# EAGLE design OSC4ReTHM (EAGLE 7.4.0)
DOC_NUM: DR20000114; REV: 04
Assembly variants: 12kHz, 14kHz, 16kHz, 18kHz, 20kHz
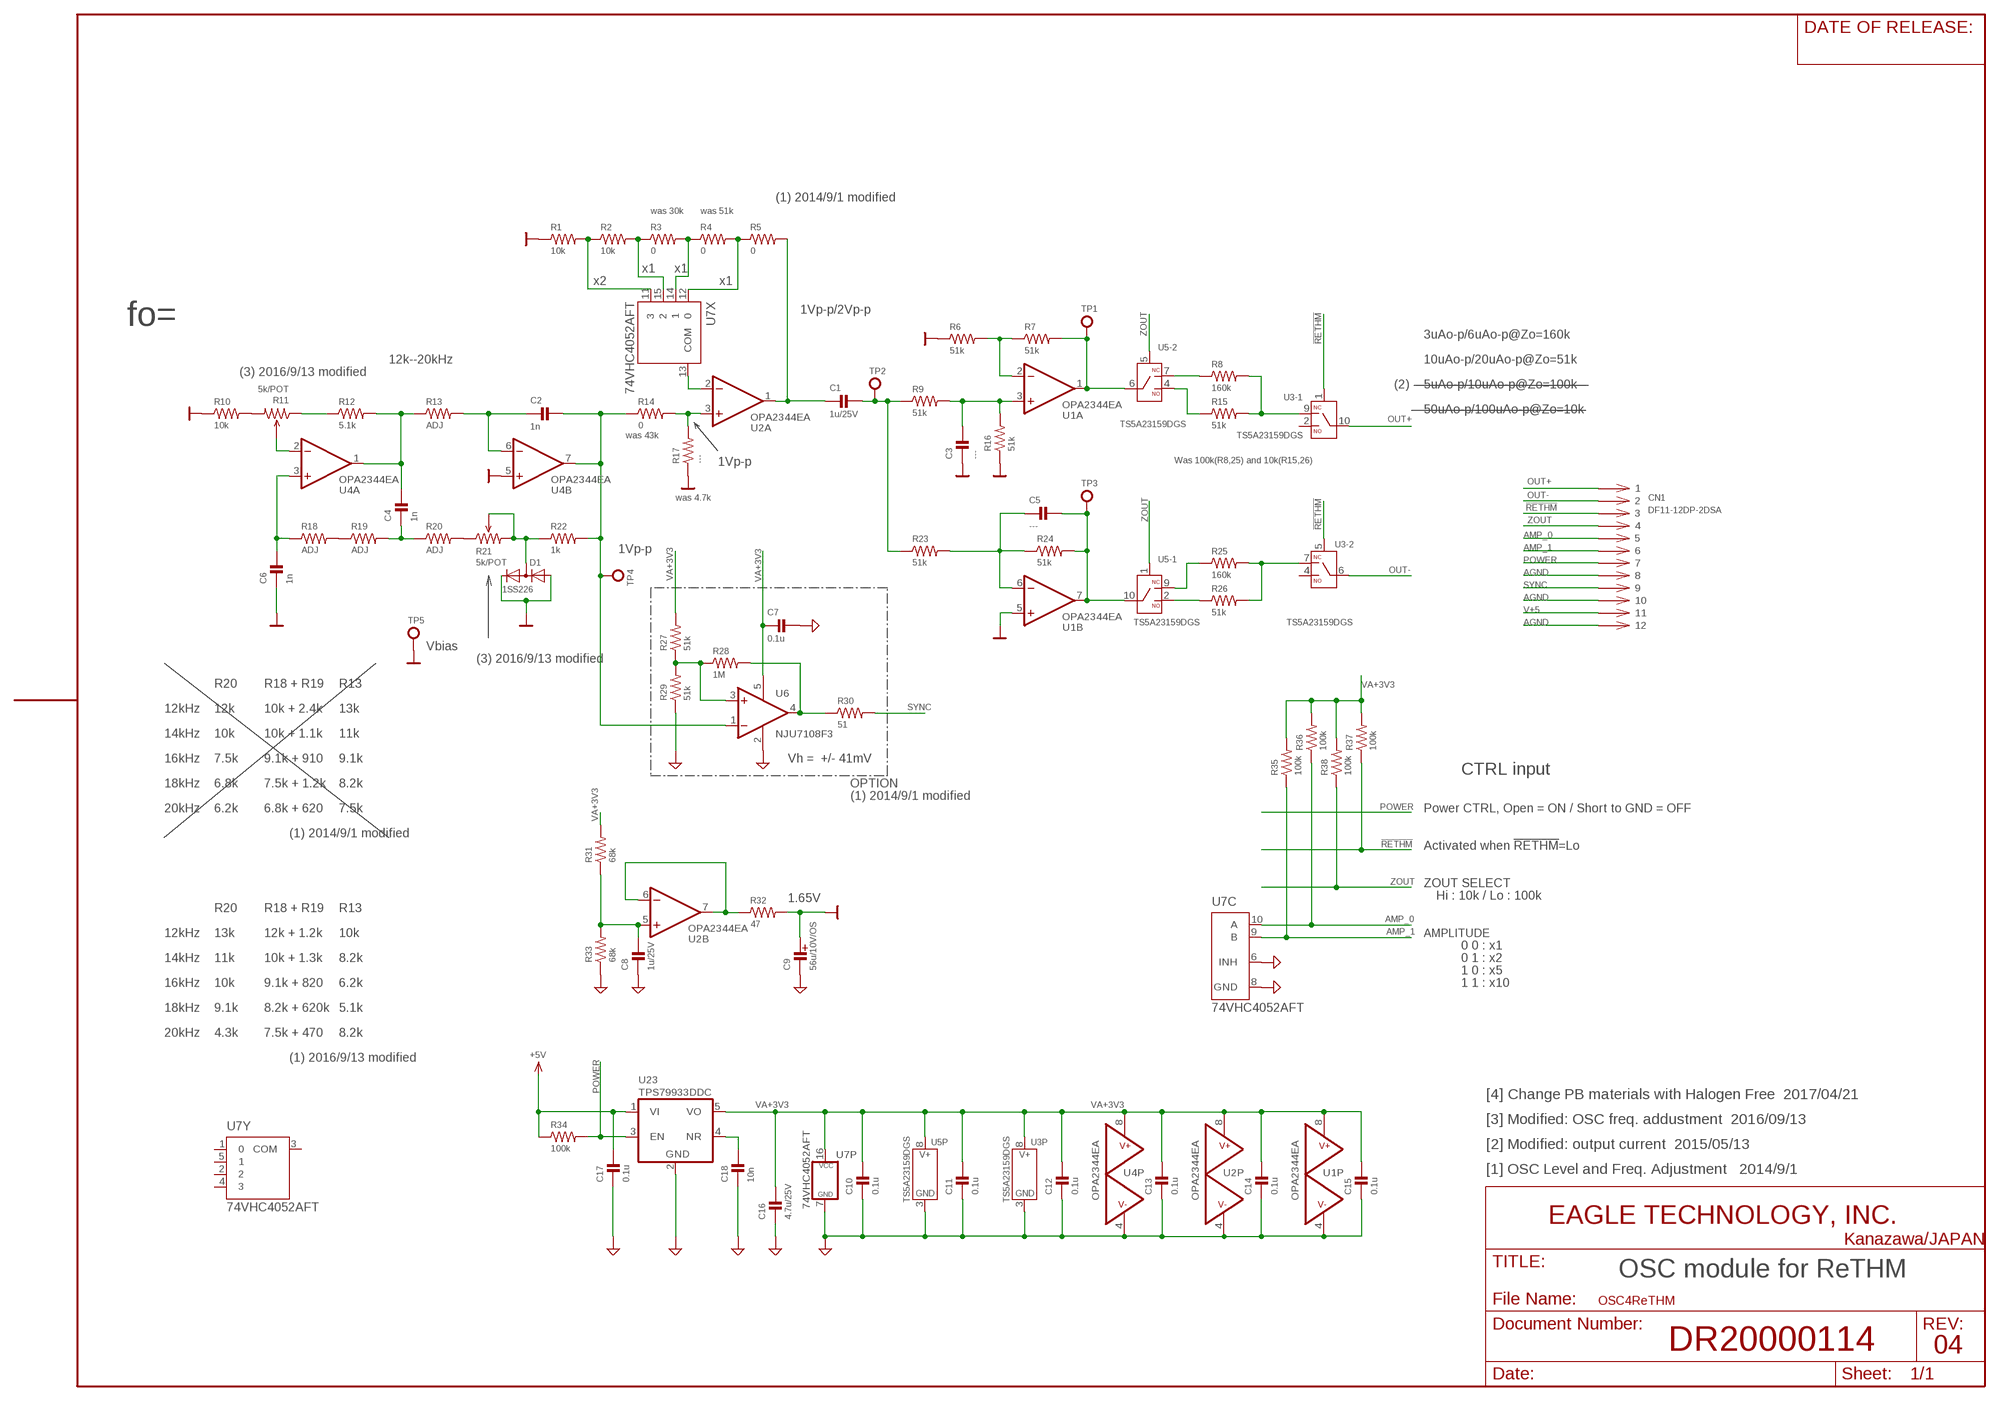
[diagram p0: schematic, sheet 1]

## Parts
C1  1u/25V  CSMD1.6X0.8MM  [CM1608]
C2  1n  CSMD2.0X1.2MM  [CM2012]
C3  ---  CSMD2.0X1.2MM  [CM2012]
C4  1n  CSMD2.0X1.2MM  [CM2012]
C5  ---  CSMD2.0X1.2MM  [CM2012]
C6  1n  CSMD2.0X1.2MM  [CM2012]
C7  0.1u  CSMD1.6X0.8MM  [CM1608]  (not fitted in variant 12kHz)  (not fitted in variant 14kHz)  (not fitted in variant 16kHz)  (not fitted in variant 18kHz)  (not fitted in variant 20kHz)
C8  1u/25V  CSMD1.6X0.8MM  [CM1608]
C9  56u/10V/OS  C_POL6.3-2.5MM  [PHI_6.3]
C10  0.1u  CSMD1.6X0.8MM  [CM1608]
C11  0.1u  CSMD1.6X0.8MM  [CM1608]
C12  0.1u  CSMD1.6X0.8MM  [CM1608]
C13  0.1u  CSMD1.6X0.8MM  [CM1608]
C14  0.1u  CSMD1.6X0.8MM  [CM1608]
C15  0.1u  CSMD1.6X0.8MM  [CM1608]
C16  4.7u/25V  CSMD2.0X1.2MM  [CM2012]
C17  0.1u  CSMD1.6X0.8MM  [CM1608]
C18  10n  CSMD2.0X1.2MM  [CM2012]
CN1  DF11-12DP-2DSA  [DF11-12DP-2DSA]
D1  1SS226  [SOT23]
R1  10k  RSMD1.6X0.8MM  [RM1608]
R2  10k  RSMD1.6X0.8MM  [RM1608]
R3  0  RSMD1.6X0.8MM  [RM1608]
R4  0  RSMD1.6X0.8MM  [RM1608]
R5  0  RSMD1.6X0.8MM  [RM1608]
R6  51k  RSMD1.6X0.8MM  [RM1608]
R7  51k  RSMD1.6X0.8MM  [RM1608]
R8  160k  RSMD1.6X0.8MM  [RM1608]
R9  51k  RSMD1.6X0.8MM  [RM1608]
R10  10k  RSMD1.6X0.8MM  [RM1608]
R11  5k/POT  R_POT  [CT-6]
R12  5.1k  RSMD1.6X0.8MM  [RM1608]
R13  ADJ  RSMD1.6X0.8MM  [RM1608]  (variant 12kHz: 13k)  (variant 14kHz: 11k)  (variant 16kHz: 10k)  (variant 18kHz: 9.1k)  (variant 20kHz: 8.2k)
R14  0  RSMD1.6X0.8MM  [RM1608]
R15  51k  RSMD1.6X0.8MM  [RM1608]
R16  51k  RSMD1.6X0.8MM  [RM1608]
R17  ---  RSMD1.6X0.8MM  [RM1608]
R18  ADJ  RSMD1.6X0.8MM  [RM1608]  (variant 12kHz: 12k)  (variant 14kHz: 10k)  (variant 16kHz: 9.1k)  (variant 18kHz: 8.2k)  (variant 20kHz: 7.5k)
R19  ADJ  RSMD1.6X0.8MM  [RM1608]  (variant 12kHz: 1.2k)  (variant 14kHz: 1.3k)  (variant 16kHz: 820)  (variant 18kHz: 620)  (variant 20kHz: 470)
R20  ADJ  RSMD1.6X0.8MM  [RM1608]  (variant 12kHz: 10k)  (variant 14kHz: 8.2k)  (variant 16kHz: 6.2k)  (variant 18kHz: 5.1k)  (variant 20kHz: 4.3k)
R21  5k/POT  R_POT  [CT-6]
R22  1k  RSMD1.6X0.8MM  [RM1608]
R23  51k  RSMD1.6X0.8MM  [RM1608]
R24  51k  RSMD1.6X0.8MM  [RM1608]
R25  160k  RSMD1.6X0.8MM  [RM1608]
R26  51k  RSMD1.6X0.8MM  [RM1608]
R27  51k  RSMD1.6X0.8MM  [RM1608]  (not fitted in variant 12kHz)  (not fitted in variant 14kHz)  (not fitted in variant 16kHz)  (not fitted in variant 18kHz)  (not fitted in variant 20kHz)
R28  1M  RSMD1.6X0.8MM  [RM1608]  (not fitted in variant 12kHz)  (not fitted in variant 14kHz)  (not fitted in variant 16kHz)  (not fitted in variant 18kHz)  (not fitted in variant 20kHz)
R29  51k  RSMD1.6X0.8MM  [RM1608]  (not fitted in variant 12kHz)  (not fitted in variant 14kHz)  (not fitted in variant 16kHz)  (not fitted in variant 18kHz)  (not fitted in variant 20kHz)
R30  51  RSMD1.6X0.8MM  [RM1608]  (not fitted in variant 12kHz)  (not fitted in variant 14kHz)  (not fitted in variant 16kHz)  (not fitted in variant 18kHz)  (not fitted in variant 20kHz)
R31  68k  RSMD1.6X0.8MM  [RM1608]
R32  47  RSMD1.6X0.8MM  [RM1608]
R33  68k  RSMD1.6X0.8MM  [RM1608]
R34  100k  RSMD1.6X0.8MM  [RM1608]
R35  100k  RSMD1.6X0.8MM  [RM1608]
R36  100k  RSMD1.6X0.8MM  [RM1608]
R37  100k  RSMD1.6X0.8MM  [RM1608]
R38  100k  RSMD1.6X0.8MM  [RM1608]
TP1  TP-1PAD  [TP_PAD_1MM]
TP2  TP-LC3G  [TP_TH_0R9MM]
TP3  TP-1PAD  [TP_PAD_1MM]
TP4  TP-LC3G  [TP_TH_0R9MM]
TP5  TP-1PAD  [TP_PAD_1MM]
U1  OPA2344EA  OPA2344DGK  [MSO8_AEL]
U2  OPA2344EA  OPA2344DGK  [MSO8_AEL]
U3  TS5A23159DGS  [MSOP10]
U4  OPA2344EA  OPA2344DGK  [MSO8_AEL]
U5  TS5A23159DGS  [MSOP10]
U6  NJU7108F3  [SC88A]  (not fitted in variant 12kHz)  (not fitted in variant 14kHz)  (not fitted in variant 16kHz)  (not fitted in variant 18kHz)  (not fitted in variant 20kHz)
U7  74VHC4052AFT  [TSSOP16-P-044-065A]
U23  TPS79933DDC  [SOT-23-5]

## Nets
0V: C3.2 C6.2 C9.POS D1.1(A) D1.2(C) R1.1 R6.1 R10.1 R16.1 R17.1 R32.2 TP5.P$1(MP) U1.5(B:+IN) U4.5(B:+IN)
!RETHM: CN1.3 R37.1 U3.1(-1:IN) U3.5(-2:IN)
AGND: C7.1 C8.2 C9.NEG C10.2 C11.2 C12.2 C13.2 C14.2 C15.2 C16.2 C17.2 C18.2 CN1.8 CN1.10 CN1.12 R29.1 R33.1 U1.4(P:V-) U2.4(P:V-) U3.3(P:V-) U4.4(P:V-) U5.3(P:V-) U6.2(V-) U7.6(C:INH) U7.7(P:GND) U7.8(C:GND) U23.2(GND)
AMP_0: CN1.5 R36.1 U7.10(C:A)
AMP_1: CN1.6 R35.1 U7.9(C:B)
N$11: R20.2 R21.1
N$13: R10.2 R11.3
N$15: C18.1 U23.4(NR)
N$19: R1.2 R2.1 U7.11
N$21: R2.2 R3.1 U7.15
N$22: R3.2 R4.1 U7.14
N$25: R4.2 R5.1 U7.12
N$26: C8.1 R31.1 R33.2 U2.5(B:+IN)
N$27: C5.2 R23.2 R24.1 U1.6(B:-IN)
N$28: U2.2(A:-IN) U7.13(X:COM)
N$29: C1.2 R5.2 U2.1(A:OUT)
N$30: R14.2 R17.2 U2.3(A:+IN)
N$31: C5.1 R24.2 TP3.P$1(MP) U1.7(B:OUT) U5.10(-1:COM)
N$32: R7.2 TP1.P$1(MP) U1.1(A:OUT) U5.6(-2:COM)
N$33: R6.2 R7.1 U1.2(A:-IN)
N$34: C3.1 R9.2 R16.2 U1.3(A:+IN)
N$35: R26.1 U5.2(-1:NO)
N$36: R25.1 U5.9(-1:NC)
N$37: R25.2 R26.2 U3.7(-2:NC)
N$38: R8.1 U5.7(-2:NC)
N$39: R15.1 U5.4(-2:NO)
N$40: R8.2 R15.2 U3.9(-1:NC)
N$41: R11.1 R12.1
N$42: C4.1 R12.2 R13.1 U4.1(A:OUT)
N$43: C2.2 R13.2 U4.6(B:-IN)
N$44: C2.1 R14.1 R22.2 TP4.1(MP) U4.7(B:OUT) U6.1(-IN)
N$45: R11.2 U4.2(A:-IN)
N$46: C6.1 R18.1 U4.3(A:+IN)
N$47: R18.2 R19.1
N$48: C4.2 R19.2 R20.1
N$49: D1.3(AC) R21.2 R21.3 R22.1
N$51: C1.1 R9.1 R23.1 TP2.1(MP)
N$52: R32.1 U2.6(B:-IN) U2.7(B:OUT)
N$57: R27.1 R28.1 R29.2 U6.3(+IN)
N$58: R28.2 R30.1 U6.4(OUT)
OUT+: CN1.1 U3.10(-1:COM)
OUT-: CN1.2 U3.6(-2:COM)
POWER: CN1.7 R34.2 U23.3(EN)
SYNC: CN1.9 R30.2
V+5: C17.1 CN1.11 R34.1 U23.1(VI)
VA+3V3: C7.2 C10.1 C11.1 C12.1 C13.1 C14.1 C15.1 C16.1 R27.2 R31.2 R35.2 R36.2 R37.2 R38.2 U1.8(P:V+) U2.8(P:V+) U3.8(P:V+) U4.8(P:V+) U5.8(P:V+) U6.5(V+) U7.16(P:VCC) U23.5(VO)
ZOUT: CN1.4 R38.1 U5.1(-1:IN) U5.5(-2:IN)
Unconnected: U3.2(-1:NO) U3.4(-2:NO) U7.1 U7.2 U7.3(Y:COM) U7.4 U7.5

## Notes on the sheet
- (1) 2014/9/1 modified
- was 30k | was 51k
- x1 | x1
- x2 | x1
- 1Vp-p/2Vp-p
- fo=
- 3uAo-p/6uAo-p@Zo=160k
- 12k--20kHz | 10uAo-p/20uAo-p@Zo=51k
- (3) 2016/9/13 modified
- (2) | 5uAo-p/10uAo-p@Zo=100k
- 50uAo-p/100uAo-p@Zo=10k
- was 43k
- Was 100k(R8,25) and 10k(R15,26)
- 1Vp-p
- was 4.7k
- 1Vp-p
- Vbias
- (3) 2016/9/13 modified
- R20 | R18 + R19 | R13
- 12kHz | 12k | 10k + 2.4k | 13k
- 14kHz | 10k | 10k + 1.1k | 11k
- 16kHz | 7.5k | 9.1k + 910 | 9.1k | Vh =  +/- 41mV
- CTRL input
- 18kHz | 6.8k | 7.5k + 1.2k | 8.2k | OPTION
- (1) 2014/9/1 modified
- 20kHz | 6.2k | 6.8k + 620 | 7.5k | Power CTRL, Open = ON / Short to GND = OFF
- (1) 2014/9/1 modified
- Activated when !RETHM!=Lo
- ZOUT SELECT
- 1.65V | Hi : 10k / Lo : 100k
- R20 | R18 + R19 | R13
- 12kHz | 13k | 12k + 1.2k | 10k | AMPLITUDE
- 0 0 : x1
- 14kHz | 11k | 10k + 1.3k | 8.2k | 0 1 : x2
- 1 0 : x5
- 16kHz | 10k | 9.1k + 820 | 6.2k | 1 1 : x10
- 18kHz | 9.1k | 8.2k + 620k | 5.1k
- 20kHz | 4.3k | 7.5k + 470 | 8.2k
- (1) 2016/9/13 modified
- [4] Change PB materials with Halogen Free  2017/04/21
- [3] Modified: OSC freq. addustment  2016/09/13
- [2] Modified: output current  2015/05/13
- [1] OSC Level and Freq. Adjustment   2014/9/1
- OSC module for ReTHM

## Library data of the parts
C1-C8 C10-C18 = AEL_RLC:C: CAPACITOR, European symbol
C9 = AEL_RLC:C_POL: POL Cap Nihon-Chemicon Read components UVR1H100 10uF 5phi, 2.0mm pitch UVR1H470 47uF 6.3phi, 2.5mm pitch UVR1H101 100uF 8phi, 3.5mm pitch Panasonic SO package J16 : 17x17 - 17mm Height H13: 14x14 - 15mm Height
CN1 = AEL_terminal:DF11-12DP-2DS*
D1 = AEL_diode:1SS*: Toshiba Diode TO236 Package 1:Anode1, 2:Casode2, 3:Anode2/Casode1; CT: 0.9pF; VF: 0.9V
R1-R10 R12-R20 R22-R38 = AEL_RLC:R: RESISTOR, American symbol
R11 R21 = AEL_RLC:R_POT
TP1-TP5 = AEL_terminal:TP-*: Testpoint
U1 U2 U4 = AEL_linear:OPA2344: TI OP AMP OPA2344 Low Vcc RRIO GBW = 1MHz 0.8V/usec Voff = 1mVmax / 3uV/deg Vcc = 2.7 to 5.5 V / Icc0.15mA./amp
U3 U5 = AEL_linear:TS5A23159: TI Analog SW / 2 x SPDT
U6 = AEL_linear:NJU7108: COMPARATOR JRC NJU7108 Low Power Voltage 1.0-5.5V/10uA Voff = 4mV Push-Pull output tp = 500ns/190ns
U7 = AEL_CMOS_LOG:74*4052: STD C-MOS Analog MPX 2 x 4 to 1 74**4051 Avairable Technology: HC VHC
U23 = AEL_linear:TPS799*: TI LDO TSOT23-5 package Iout = 200mAmax Vdrop = 100mV min Cout >= 2.0uF cer With ENABLE Function

## Board
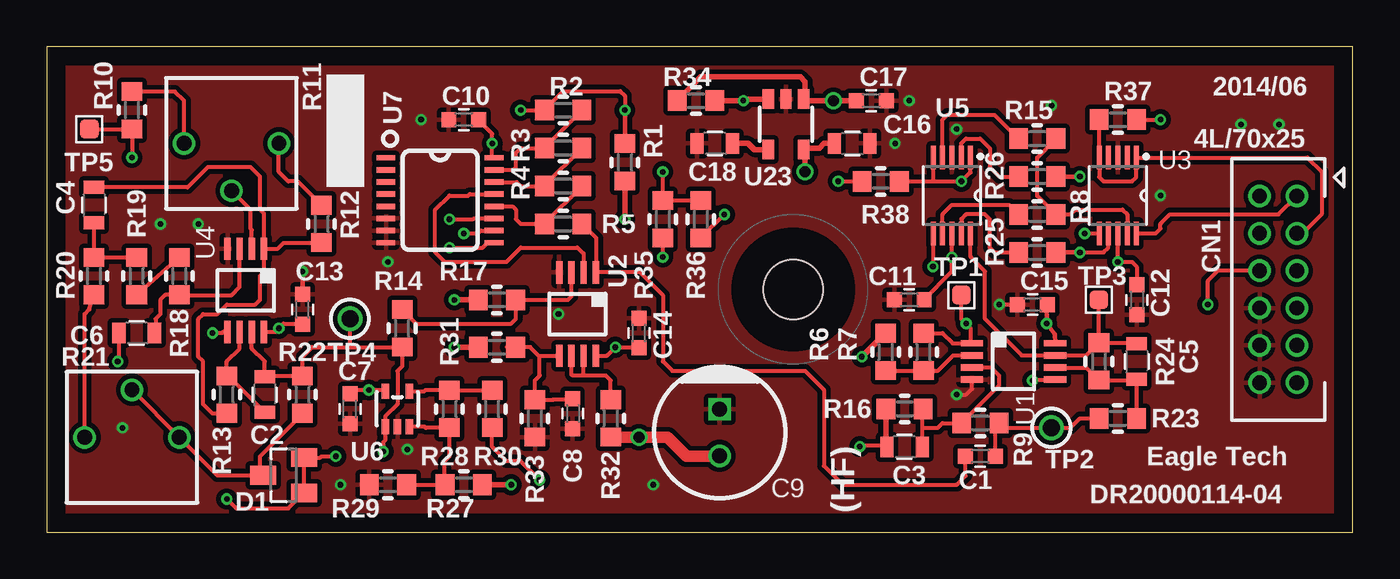
[diagram p1: board, top side]
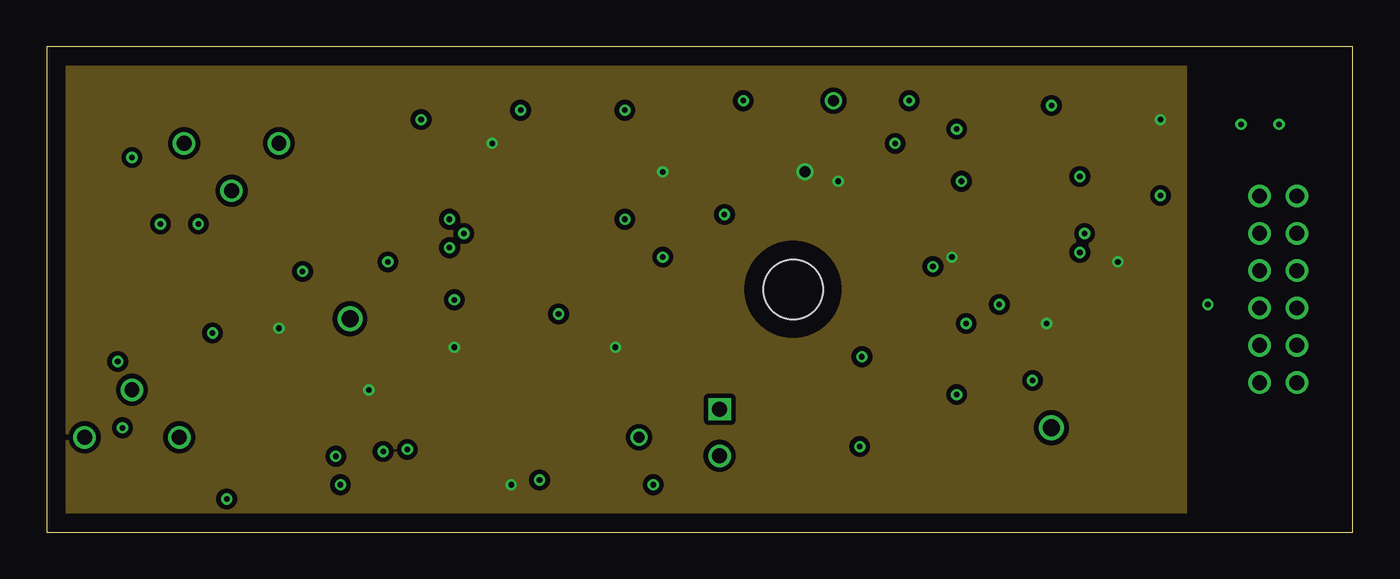
[diagram p2: board, inner layer Route2]
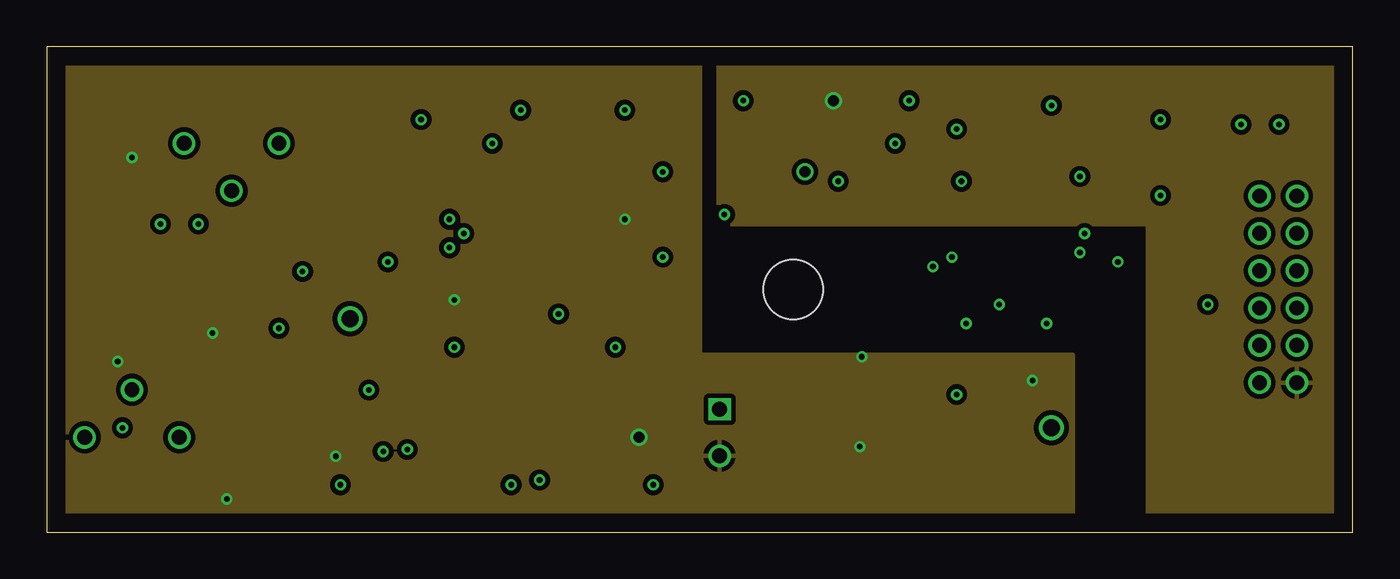
[diagram p3: board, inner layer Route15]
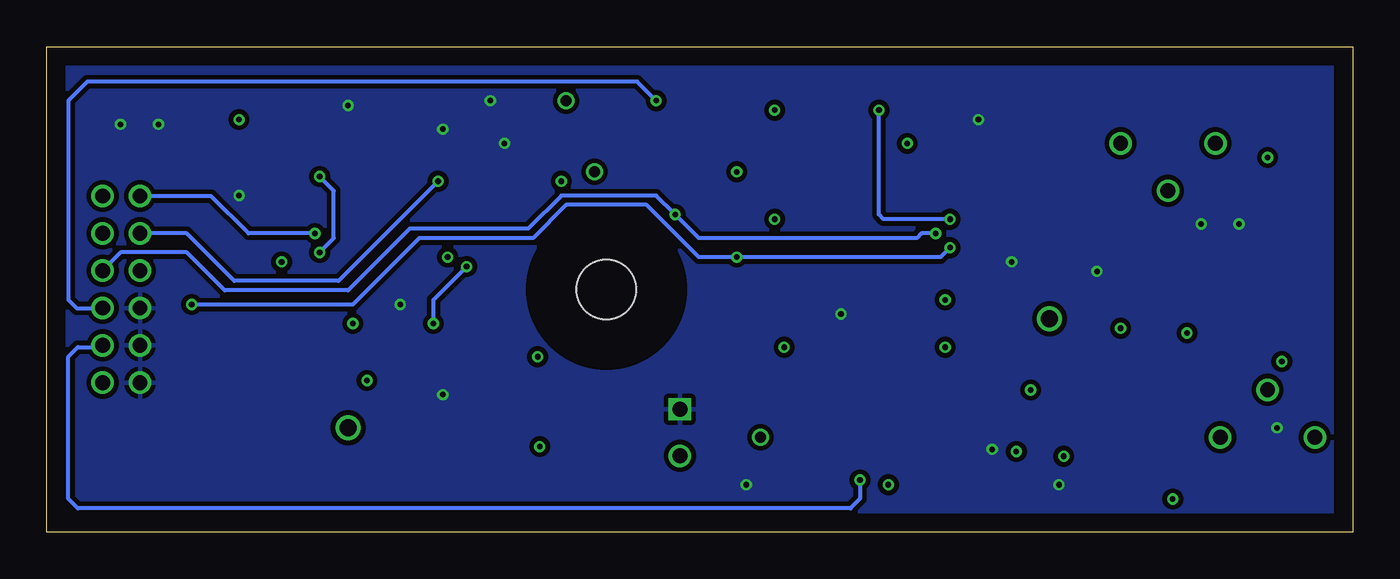
[diagram p4: board, bottom side, seen from below]

Size 70 x 26 mm. Coordinates in mm from the lower left corner, seen from the top.
Outline: 0,0 70,0 70,26 0,26 0,0
Copper layers (1+2*15+16): Top 0.018mm / dielectric 0.25mm / Route2 0.035mm / dielectric 1mm / Route15 0.035mm / dielectric 0.25mm / Bottom 0.018mm
Design rules "pban_5mil-l4 *": minimum track width 5mil, minimum drill 0.3mm, track to track 5mil, track to pad 0.229mm, pad to pad 5mil, via to via 5mil, smd to smd 5mil, copper to edge 1mm, drill to drill 0.5mm, minimum pad ring 0.15mm, minimum via ring 0.15mm, stop-mask expansion 0.05mm, vias tented up to drill 0.35mm, thermal gap 10mil
Holes 3.2 mm at 40,13
tRestrict: area 37,10 to 43,16
bRestrict: area 36,9 to 44,17

### Footprints (pad centres in the part's own frame; a part is rotated, then mirrored left to right if it is on the bottom)
CM1608 = smd 0.8 x 0.8: 1 -0.8,0; 2 0.8,0
CM2012 = smd 0.7 x 1.1: 1 -0.95,0; 2 0.95,0
PHI_6.3 = drill 0.8 square: NEG 0,-1.25 | drill 0.8: POS 0,1.25
DF11-12DP-2DSA = drill 0.8: 1 5,-1; 2 5,1; 3 3,-1; 4 3,1; 5 1,-1; 6 1,1; 7 -1,-1; 8 -1,1; 9 -3,-1; 10 -3,1; 11 -5,-1; 12 -5,1
SOT23 = smd 1 x 1.4: 1 -0.95,-1.1; 2 0.95,-1.1; 3 0,1.1
RM1608 = smd 1 x 1.1: 1 -1,0; 2 1,0
CT-6 = drill 0.8: 1 -2.54,0; 2 0,2.54; 3 2.54,0
TP_PAD_1MM = smd 1 x 1: P$1 0,0
TP_TH_0R9MM = drill 0.9: 1 0,0
MSO8_AEL = smd 0.34 x 1.19: 1 -0.975,-2.23; 2 -0.325,-2.23; 3 0.325,-2.23; 4 0.975,-2.23; 5 0.975,2.23; 6 0.325,2.23; 7 -0.325,2.23; 8 -0.975,2.23
MSOP10 = smd 1.27 x 0.279: 1 -2.032,0.991; 2 -2.032,0.508; 3 -2.032,0; 4 -2.032,-0.508; 5 -2.032,-0.991; 6 2.032,-0.991; 7 2.032,-0.508; 8 2.032,0; 9 2.032,0.508; 10 2.032,0.991
SC88A = smd 0.4 x 0.8: 1 -0.65,-0.95; 2 0,-0.95; 3 0.65,-0.95; 4 0.65,0.95; 5 -0.65,0.95
TSSOP16-P-044-065A = smd 0.29 x 1: 1 -2.275,-2.9; 2 -1.625,-2.9; 3 -0.975,-2.9; 4 -0.325,-2.9; 5 0.325,-2.9; 6 0.975,-2.9; 7 1.625,-2.9; 8 2.275,-2.9; 9 2.275,2.9; 10 1.625,2.9; 11 0.975,2.9; 12 0.325,2.9; 13 -0.325,2.9; 14 -0.975,2.9; 15 -1.625,2.9; 16 -2.275,2.9
SOT-23-5 = smd 0.6 x 1.05: 1 -0.95,-1.35; 2 0,-1.35; 3 0.95,-1.35; 4 0.95,1.35; 5 -0.95,1.35

### Placement (x,y rotation side)
C1  50.04,4.06 180 top
C2  11.68,7.36 270 top
C3  45.97,4.56 180 top
C4  2.54,17.52 270 top
C5  58.42,9.14 270 top
C6  4.83,10.66 180 top
C7  16.26,6.6 90 top  (not fitted)
C8  28.19,6.34 270 top
C9  36.07,5.33 180 top
C10  22.35,22.09 180 top
C11  46.23,12.44 180 top
C12  58.42,12.44 270 top
C13  13.72,11.93 90 top
C14  31.75,10.66 90 top
C15  52.83,12.18 180 top
C16  43.18,20.82 0 top
C17  44.2,23.11 0 top
C18  35.81,20.82 180 top
CN1  66,13 90 top
D1  12.7,3.04 90 top
R1  30.99,19.8 90 top
R2  27.69,22.6 0 top
R3  27.69,20.57 0 top
R4  27.69,18.53 0 top
R5  27.69,16.5 0 top
R6  44.96,9.64 270 top
R7  46.99,9.64 90 top
R8  53.09,17.01 0 top
R9  50.04,5.83 180 top
R10  4.57,22.6 90 top
R11  9.91,20.82 180 top
R12  14.73,16.5 270 top
R13  13k  [RM1608]  9.65,7.36 90 top
R14  19.05,10.91 90 top
R15  53.09,21.07 0 top
R16  45.97,6.6 0 top
R17  24.13,12.44 0 top
R18  12k  [RM1608]  7.11,13.71 90 top
R19  1.2k  [RM1608]  4.83,13.71 90 top
R20  10k  [RM1608]  2.54,13.71 270 top
R21  4.57,5.07 0 top
R22  13.72,7.36 90 top
R23  57.4,6.09 0 top
R24  56.39,9.14 90 top
R25  53.09,14.98 0 top
R26  53.09,19.04 0 top
R27  22.35,2.53 0 top  (not fitted)
R28  21.59,6.6 90 top  (not fitted)
R29  18.29,2.53 0 top  (not fitted)
R30  23.88,6.6 270 top  (not fitted)
R31  24.13,9.9 180 top
R32  30.23,6.09 270 top
R33  26.16,6.09 90 top
R34  34.8,23.11 0 top
R35  33.02,16.76 90 top
R36  35.05,16.76 90 top
R37  57.4,22.09 0 top
R38  44.7,18.79 180 top
TP1  49.02,12.69 90 top
TP2  53.85,5.58 90 top
TP3  56.39,12.44 90 top
TP4  16.26,11.42 0 top
TP5  2.29,21.58 0 top
U1  51.82,9.14 270 top
U2  28.45,11.68 180 top
U3  57.4,18.03 270 top
U4  10.67,12.95 180 top
U5  48.51,18.03 270 top
U6  18.8,6.6 0 top  (not fitted)
U7  21.08,17.77 270 top
U23  39.62,21.84 180 top

### Tracks (layer width: path | path; a pad name or v marks a point on that pad's centre or on a via)
0V  (via drill 0.3, 0.6)
  Top 0.203: U4.5 9.45,10.72 9.4,10.66 v8.89,10.66 | v9.65,1.77 10.16,1.26 12.95,1.26 13.78,2.09 D1.1 D1.2 14.67,3.99 14.73,4.06 v15.49,4.06 | C6.2 3.88,9.2 v3.81,9.14 | v4.57,20.06 R10.1 4.56,21.58 TP5.P$1 | U1.5 52.87,8.16 v52.83,8.12 | 44.97,4.61 43.62,4.61 v43.58,4.57
  Top 0.305: v21.84,12.44 R17.1 | v30.99,16.76 R1.1 | R6.1 v43.69,9.39 | R16.1 44.97,4.61 C3.2
  Top 0.61: R32.2 v31.75,5.07 33.27,5.07 34.29,4.06 36.05,4.06 C9.POS
  pour Route15 (isolate 0.254): 0,0 55,0 55,9.5 35,9.5 35,26 0,26
!RETHM
  Top 0.203: R37.1 U3.5 56.41,19.02 56.64,18.79 58.17,18.79 58.4,19.02 U3.1 67.56,20.06 68.33,19.3 68.33,17.01 67.32,16 CN1.3
AGND  (via drill 0.3)
  Top 0.203: U1.4 49.59,7.67 49.28,7.36 v48.77,7.36 | C15.2 v51.05,12.18
  Top 0.254: C13.2 v13.72,13.96
  other vias: 8.13,16.5 27.43,11.68 18.29,14.47 20.07,22.09 48.77,21.58 19.33,4.43 15.75,2.53 4.06,5.58 46.23,23.11 45.47,20.82 6.1,16.5 32.51,2.53 64.01,21.84 66.04,21.84 59.69,18.03 53.85,22.85
  pour Top (isolate 0.254): 0,0 70,0 70,26 0,26
  pour Bottom (isolate 0.254): 0,0 70,0 70,26 0,26
AMP_0  (via drill 0.3)
  Top 0.203: U7.10 23.27,16.15 23.11,15.99 v22.35,15.99 | v36.32,17.01 R36.1
  Bottom 0.203: v22.35,15.99 23.11,15.99 23.37,15.74 35.05,15.74 v36.32,17.01 37.34,18.03 42.42,18.03 44.2,16.25 50.55,16.25 53.85,12.95 60.45,12.95 62.48,14.98 66.04,14.98 67,14.02 CN1.5
AMP_1  (via drill 0.3)
  Top 0.203: U7.9 23.63,15.5 23.37,15.23 v21.59,15.23 | v33.02,14.72 R35.1 | v62.23,12.18 62.23,13.45 62.8,14.02 65.09,14.02 65.02,13.96 CN1.6
  Bottom 0.203: v21.59,15.23 22.1,14.72 v33.02,14.72 35.05,14.72 37.85,17.52 42.16,17.52 43.94,15.74 50.04,15.74 53.59,12.18 v62.23,12.18
N$11
  Top 0.203: R20.2 2.29,11.93 2.03,11.68 R21.1
N$13
  Top 0.203: R10.2 6.87,23.6 7.37,23.11 R11.3
N$15
  Top 0.305: U23.4 37.93,20.49 37.59,20.82 C18.1
N$19  (via drill 0.3)
  Top 0.203: U7.11 22.9,16.8 22.86,16.76 v21.59,16.76 | v25.4,22.6 R2.1 26.69,22.61 27.69,23.61 30.73,23.61 30.99,23.36 v30.99,22.6
  Top 0.254: v30.99,22.6 R1.2
  Bottom 0.203: v25.4,22.6 25.4,17.01 25.15,16.76 v21.59,16.76
N$21
  Top 0.203: U7.15 24.99,19.4 25.15,19.55 25.15,20.31 25.4,20.57 R3.1 26.69,20.6 R2.2
N$22
  Top 0.203: U7.14 25.19,18.75 25.4,18.53 R4.1 26.69,18.57 R3.2
N$25
  Top 0.203: U7.12 24.96,17.45 25.15,17.26 25.15,16.76 25.4,16.5 R5.1 26.69,16.53 R4.2
N$26
  Top 0.203: 26.36,9.45 U2.5 | 26.36,9.45 25.91,9.9 R31.1 24.65,9.9 | C8.1 28.16,7.1 27.18,7.1 27.16,7.09 R33.2 26.16,8.12 26.42,8.37 26.42,9.39 26.36,9.45
N$27
  Top 0.203: R23.2 58.4,8.17 C5.2 58.37,8.14 R24.1 55.71,8.81 U1.6
N$28
  Top 0.203: U2.2 28.77,14.91 28.45,15.23 25.4,15.23 24.64,14.47 21.34,14.47 20.83,14.98 20.83,17.26 21.59,18.03 22.61,18.03 22.68,18.1 U7.13
N$29
  Top 0.203: R5.2 28.7,16.5 29.46,15.74 29.46,13.95 | U2.1 29.46,13.95 | 29.46,13.95 31.77,13.95 33.02,12.69 33.02,9.14 33.53,8.63 40.64,8.63 41.66,7.61 41.66,3.55 42.67,2.53 48.77,2.53 49.24,3 C1.2
N$30
  Top 0.203: U2.3 28.12,12.62 27.94,12.44 R17.2 25.15,12.2 25.15,11.42 24.89,11.17 19.81,11.17 19.3,11.68 R14.2
N$31
  Top 0.203: R24.2 55.71,9.46 U1.7 52.25,9.46 50.29,11.42 50.29,13.96 49.51,14.75 U5.10 | R24.2 58.37,10.14 C5.1 | R24.2 TP3.P$1
N$32  (via drill 0.3)
  Top 0.203: R7.2 47.01,10.66 48.01,10.66 48.55,10.11 U1.1 49.53,10.17 49.53,10.91 v49.28,11.17 49.02,11.42 TP1.P$1 | U5.6 47.52,14.24 v47.5,14.22
  Bottom 0.203: v47.5,14.22 49.28,12.44 v49.28,11.17
N$33
  Top 0.203: R6.2 R7.1 47.77,8.64 48.59,9.46 U1.2
N$34
  Top 0.203: C3.1 46.92,5.58 | 46.92,5.58 46.92,6.55 R16.2 | 46.92,5.58 47.75,5.58 48.01,5.83 R9.2 49.04,5.85 51.05,7.87 51.05,8.37 50.62,8.81 U1.3
N$35
  Top 0.203: R26.1 51.05,19.04 50.55,19.55 50.55,20.57 50.04,21.07 49.28,21.07 49.02,20.82 U5.2
N$36
  Top 0.203: U5.9 49.02,16.76 49.28,17.01 50.29,17.01 50.55,16.76 50.55,15.23 50.8,14.98 R25.1
N$37  (via drill 0.3)
  Top 0.203: U3.7 56.9,15.23 56.64,14.98 v55.37,14.98
  Top 0.254: v55.37,19.04 R26.2 | R25.2 v55.37,14.98
  Bottom 0.203: v55.37,19.04 54.61,18.28 54.61,15.74 v55.37,14.98
N$38
  Top 0.203: U5.7 48.01,17.01 48.51,17.52 51.58,17.52 R8.1
  Top 0.254: R8.1 51.96,17.03
N$39
  Top 0.203: U5.4 48.01,22.09 48.26,22.34 50.8,22.34 51.82,21.33 R15.1
N$40
  Top 0.203: R15.2 54.09,21.06 53.09,20.06 53.09,18.01 R8.2 54.86,17.01 55.12,17.26 57.66,17.26 57.91,17.01 U3.9
N$41
  Top 0.203: R11.1 12.45,19.3 12.95,18.79 13.45,18.79 R12.1
N$42
  Top 0.203: R13.1 9.65,6.34 8.89,6.34 8.38,6.85 8.38,9.14 8.13,9.39 8.13,11.42 8.38,11.68 9.14,11.68 9.65,12.18 11.18,12.18 11.43,12.44 11.43,13.71 11.64,14 U4.1 | U4.1 12.39,15.18 12.7,15.49 14.72,15.49 R12.2 | C4.1 7.55,18.47 8.64,19.55 10.92,19.55 11.43,19.04 11.43,17.26 11.64,17.05 U4.1
N$43
  Top 0.203: U4.6 10.34,9.83 9.65,9.14 R13.2 9.73,8.36 C2.2
N$44  (via drill 0.3)
  Top 0.203: U4.7 10.99,9.83 11.68,9.14 C2.1 11.73,8.36 R22.2 13.72,9.39 14.22,9.9 16.26,9.9 | v18.03,4.31 18.03,4.82 18.15,4.93 U6.1 18.15,6.2 18.8,6.85 18.8,8.63 19.05,8.88 R14.1 19.03,9.9 16.26,9.9 | 16.26,9.9 TP4.1
N$45
  Top 0.203: R11.2 10.92,17.26 10.92,16.25 10.99,16.18 U4.2
N$46
  Top 0.203: U4.3 10.34,13.13 9.91,12.69 7.13,12.69 R18.1 6.37,12.71 6.1,12.44 6.1,11.68 5.84,11.42 5.84,10.73 C6.1
N$47
  Top 0.203: R19.1 R18.2
N$48
  Top 0.203: C4.2 R20.1 R19.2
N$49
  Top 0.203: R21.2 R21.3 9.14,3.04 D1.3 11.68,3.12 11.43,3.29 11.43,4.06 13.48,6.1 R22.1
N$51
  Top 0.203: R23.1 55.37,6.09 54.86,5.58 TP2.1 51.31,5.58 51.05,5.83 R9.1 50.84,5.63 C1.1
N$52
  Top 0.203: U2.6 28.12,8.45 28.19,8.37 28.7,8.37 | R32.1 30.23,8.12 29.97,8.37 28.7,8.37 | U2.7 28.77,8.45 28.7,8.37
N$57
  Top 0.203: U6.3 20.25,5.65 20.32,5.58 21.57,5.58 R28.1 21.59,4.06 21.34,3.8 21.34,2.55 R27.1 R29.2
N$58
  Top 0.203: U6.4 20.25,7.55 20.32,7.61 21.57,7.61 R28.2 R30.1
OUT+
  Top 0.203: U3.10 59.44,15.99 59.69,16.25 59.69,16.5 60.2,17.01 66.01,17.01 CN1.1
OUT-  (via drill 0.3)
  Top 0.203: v55.63,15.99 56.39,15.99 56.39,15.97 U3.6
  Bottom 0.203: CN1.2 61.19,18 59.18,15.99 v55.63,15.99
POWER  (via drill 0.3)
  Top 0.305: U23.3 37.42,23.19 v37.34,23.11 R34.2
  Bottom 0.203: CN1.7 68.4,12 68.83,12.44 68.83,23.11 67.82,24.12 38.35,24.12 v37.34,23.11
SYNC  (via drill 0.3)
  Top 0.203: R30.2 23.88,4.56 24.64,3.8 25.4,3.8 v26.42,2.79
  Bottom 0.203: v26.42,2.79 26.42,1.77 26.92,1.26 68.33,1.26 68.83,1.77 68.83,9.39 68.33,9.9 67.1,9.9 CN1.9
V+5  (via drill 0.6)
  Top 0.305: C17.1 v42.16,23.11 40.65,23.11 U23.1 40.64,23.25 40.64,24.12 40.39,24.38 35.05,24.38 34.56,23.88 R34.1
  pour Route15 (isolate 0.254): 36,26 36,16.5 59,16.5 59,0.5 70,0.5 70,26
VA+3V3  (via drill 0.3, 0.6)
  Top 0.203: U4.8 12.19,10.72 | 12.19,10.72 12.25,10.72 v12.45,10.91 | v12.45,10.91 12.7,11.17 13.68,11.17 C13.1 | v12.45,10.91 12.39,10.91 12.19,10.72 | C7.2 16.26,7.61 v17.27,7.61 18.08,7.61 U6.5 | C10.1 23.15,22.05 23.88,21.33 v23.88,20.82 23.88,20.15 U7.16 | 31.6,9.91 v30.49,9.91 v30.48,9.9 30.03,9.45 U2.8 | U5.8 v48.51,14.72 48.51,13.96 47.03,12.48 C11.1 | U3.8 v57.4,14.47 58.17,14.47 58.42,14.22 C12.1 | v42.42,18.79 R38.2 | R37.2 v59.69,22.09 | v33.02,19.3 R35.2 R36.2
  Top 0.254: 31.6,9.91 C14.1 | U1.8 54.04,10.61 v53.59,11.17 53.59,12.29 C15.1
  Top 0.305: R27.2 v24.89,2.53 | C16.1 41.66,20.82 41.4,20.57 40.65,20.57 U23.5 40.57,20.38 40.64,20.31 v40.64,19.3 | v21.84,9.9 R31.2
  pour Route2 (isolate 0.254): 0,0 61,0 61,26 0,26
ZOUT  (via drill 0.3)
  Top 0.203: U5.1 49.51,19.27 v49.02,18.79 47.5,18.79 | R38.1 47.5,18.79 | U5.5 47.52,18.81 47.5,18.79
  Bottom 0.203: CN1.4 65.03,16 62.48,15.99 59.94,13.45 54.36,13.45 v49.02,18.79

### Text on the board
tPlace: 2014/06 | 4L/70x25 | (HF) | Eagle Tech | DR20000114-04